# EAGLE design Smart Relay v2 (EAGLE 9.6.2)
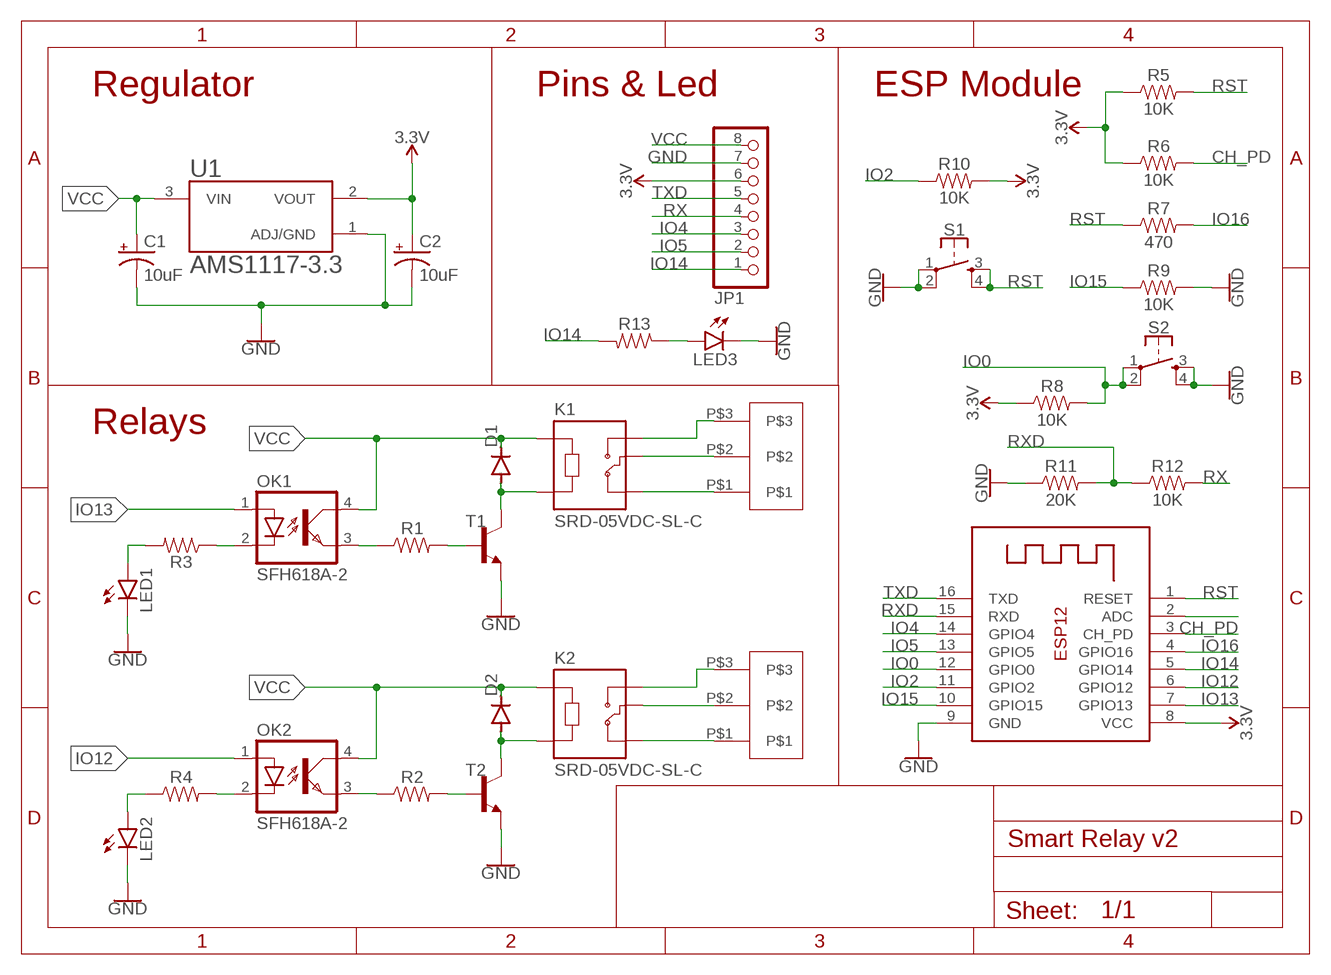
[diagram p0: schematic, sheet 1]

## Parts
C1  10uF  10UF-POLAR-EIA3216-16V-10%(TANT)  [EIA3216]
C2  10uF  10UF-POLAR-EIA3216-16V-10%(TANT)  [EIA3216]
D1  DIODE-SOD80C  [SOD80C]
D2  DIODE-SOD80C  [SOD80C]
JP1  PINHD-1X8  [1X08]
K1  SRD-05VDC-SL-C  [RELAY_SRD-05VDC-SL-C]
K2  SRD-05VDC-SL-C  [RELAY_SRD-05VDC-SL-C]
LED1  LEDCHIPLED_0805  [CHIPLED_0805]
LED2  LEDCHIPLED_0805  [CHIPLED_0805]
LED3  LEDCHIPLED_0805  [CHIPLED_0805]
OK1  SFH618A-2  [DIP4]
OK2  SFH618A-2  [DIP4]
R1  RESISTOR0805  [0805]
R2  RESISTOR0805  [0805]
R3  RESISTOR0805  [0805]
R4  RESISTOR0805  [0805]
R5  10K  RESISTOR0805  [0805]
R6  10K  RESISTOR0805  [0805]
R7  470  RESISTOR0805  [0805]
R8  10K  RESISTOR0805  [0805]
R9  10K  RESISTOR0805  [0805]
R10  10K  RESISTOR0805  [0805]
R11  20K  RESISTOR0805  [0805]
R12  10K  RESISTOR0805  [0805]
R13  RESISTOR0805  [0805]
S1  MOMENTARY-SWITCH-SPST-2-SMD-5.2MM-TALL  [TACTILE_SWITCH_SMD_5.2MM]
S2  MOMENTARY-SWITCH-SPST-2-SMD-5.2MM-TALL  [TACTILE_SWITCH_SMD_5.2MM]
T1  BC817-NPN-SOT23-BEC  [SOT23-BEC]
T2  BC817-NPN-SOT23-BEC  [SOT23-BEC]
U1  AMS1117-3.3  [SOT229P700X180-4N]
U$1  5MM_TERMINAL_3P  [5MM_TERMINAL_3P]
U$2  5MM_TERMINAL_3P  [5MM_TERMINAL_3P]
X1  ESP-12  [ESP-12]

## Nets
3.3V: C2.+ JP1.6 R5.1 R6.1 R8.1 R10.2 U1.2(VOUT) X1.8(VCC)
CH_PD: R6.2 X1.3(CH_PD)
GND: C1.- C2.- JP1.7 LED1.C LED2.C LED3.C R9.2 R11.1 S1.1 S1.2 S2.3 S2.4 T1.E T2.E U1.1(ADJ/GND) X1.9(GND)
IO0: R8.2 S2.1 S2.2 X1.12(GPIO0)
IO2: R10.1 X1.11(GPIO2)
IO4: JP1.3 X1.14(GPIO4)
IO5: JP1.2 X1.13(GPIO5)
IO12: OK2.1(A) X1.6(GPIO12)
IO13: OK1.1(A) X1.7(GPIO13)
IO14: JP1.1 R13.2 X1.5(GPIO14)
IO15: R9.1 X1.10(GPIO15)
IO16: R7.2 X1.4(GPIO16)
N$1: LED3.A R13.1
N$2: K2.NC U$2.P$1
N$3: D1.A K1.A2 T1.C
N$4: K2.COM U$2.P$2
N$5: D2.A K2.A2 T2.C
N$6: R2.2 T2.B
N$7: OK2.3(EMIT) R2.1
N$8: LED2.A R4.1
N$9: OK2.2(C) R4.2
N$10: OK1.3(EMIT) R1.1
N$11: R1.2 T1.B
N$12: LED1.A R3.2
N$13: OK1.2(C) R3.1
N$14: K2.NO U$2.P$3
N$15: X1.2(ADC)
N$16: K1.NC U$1.P$1
N$17: K1.COM U$1.P$2
N$18: K1.NO U$1.P$3
RST: R5.2 R7.1 S1.3 S1.4 X1.1(RESET)
RX: JP1.4 R12.2
RXD: R11.2 R12.1 X1.15(RXD)
TXD: JP1.5 X1.16(TXD)
VCC: C1.+ D1.C D2.C JP1.8 K1.A1 K2.A1 OK1.4(COL) OK2.4(COL) U1.3(VIN)

## Notes on the sheet
- Regulator | Pins & Led | ESP Module
- Relays

## Library data of the parts
C1 C2 = SparkFun-Capacitors:10UF-POLAR: 10.0µF polarized capacitors A capacitor is a passive two-terminal electrical component used to store electrical energy temporarily in an electric field.; PROD_ID: CAP-00811
D1 D2 = diode:DIODE-: DIODE
JP1 = pinhead:PINHD-1X8: PIN HEADER
K1 K2 = 5V Songle Röle:SRD-05VDC-SL-C: 5V Trigger Relay Module For Arduino And Raspberry Pi 5V Trigger Relay Module For Arduino And Raspberry Pi Check prices <https://pricing.snapeda.com/parts/SRD-05VDC-SL-C/Songle%20Relay/view-part?ref=eda>; AVAILABILITY: No availability data; DESCRIPTION: 5V Trigger Relay Module For Arduino And Raspberry Pi 5V Trigger Relay Module For Arduino And Raspberry Pi; MF: Songle Relay; MP: SRD-05VDC-SL-C; PACKAGE: None; PRICE: None
LED1-LED3 = led:LED: LED OSRAM: - CHIPLED LG R971, LG N971, LY N971, LG Q971, LY Q971, LO R971, LY R971 LH N974, LH R974 LS Q976, LO Q976, LY Q976 LO Q996 - Hyper CHIPLED LW Q18S LB Q993, LB Q99A, LB R99A - SideLED LS A670, LO A670, LY A670, LG A670, LP A670 LB A673, LV A673, LT A673, LW A673 LH A674 LY A675 LS A676, LA A676, LO A676, LY A676, LW A676 LS A679, LY A679, LG A679 - Hyper Micro SIDELED® LS Y876, LA Y876, LO Y876, LY Y876 LT Y87S - SmartLED LW L88C, LW L88S LB L89C, LB L89S, LG L890 LS L89K, LO L89K, LY L89K LS L896, LA L896, LO L896, LY L896 - TOPLED LS T670, LO T670, LY T670, LG T670, LP T670 LSG T670, LSP T670, LSY T670, LOP T670, LYG T670 LG T671, LOG T671, LSG T671 LB T673, LV T673, LT T673, LW T673 LH T674 LS T676, LA T676, LO T676, LY T676, LB T676, LH T676, LSB T676, LW T676 LB T67C, LV T67C, LT T67C, LS T67K, LO T67K, LY T67K, LW E67C LS E67B, LA E67B, LO E67B, LY E67B, LB E67C, LV E67C, LT E67C LW T67C LS T679, LY T679, LG T679 LS T770, LO T770, LY T770, LG T770, LP T770 LB T773, LV T773, LT T773, LW T773 LH T774 LS E675, LA E675, LY E675, LS T675 LS T776, LA T776, LO T776, LY T776, LB T776 LHGB T686 LT T68C, LB T68C - Hyper Mini TOPLED® LB M676 - Mini TOPLED Santana® LG M470 LS M47K, LO M47K, LY M47K Source: http://www.osram.convergy.de LUXEON: - LUMILED® LXK2-PW12-R00, LXK2-PW12-S00, LXK2-PW14-U00, LXK2-PW14-V00 LXK2-PM12-R00, LXK2-PM12-S00, LXK2-PM14-U00 LXK2-PE12-Q00, LXK2-PE12-R00, LXK2-PE12-S00, LXK2-PE14-T00, LXK2-PE14-U00 LXK2-PB12-K00, LXK2-PB12-L00, LXK2-PB12-M00, LXK2-PB14-N00, LXK2-PB14-P00, LXK2-PB14-Q00 LXK2-PR12-L00, LXK2-PR12-M00, LXK2-PR14-Q00, LXK2-PR14-R00 LXK2-PD12-Q00, LXK2-PD12-R00, LXK2-PD12-S00 LXK2-PH12-R00, LXK2-PH12-S00 LXK2-PL12-P00, LXK2-PL12-Q00, LXK2-PL12-R00 Source: www.luxeon.com KINGBRIGHT: KA-3528ASYC Source: www.kingbright.com
OK1 OK2 = optocoupler:SFH618?*: Optocoupler, Phototransistor Output, Low Input Current Source: Data sheet <http://www.vishay.com/docs/83673/sfh618.pdf>; MF: VISHAY/TELEFUNKEN; MPN: SFH618A-2; OC_FARNELL: 6424855; OC_NEWARK: 21H7744
R1-R13 = SparkFun-Resistors:RESISTOR: Generic Resistor Package
S1 S2 = SparkFun-Switches:MOMENTARY-SWITCH-SPST-2: Momentary Switch (Pushbutton) - SPST - Two Circuits Normally-open (NO) SPST momentary switches (buttons, pushbuttons). Schematic symbol includes two switch circuits. Variants SMD-4.6MMX2.8MM - 4.60mm x 2.80mm Tactile Momentary Button Switch - Used on SparkFun Pro Micro - RP2040 <https://www.sparkfun.com/products/17717> SMD-5.2MM - Mini Pushbutton Switch - SMD <https://www.sparkfun.com/products/8720> - Used on Arduino Pro Mini <https://www.sparkfun.com/products/11114>; PROD_ID: SWCH-14139
T1 T2 = transistor-neu-to92:*-NPN-: NPN Transistror
U1 = AMS1117-3.3:AMS1117-3.3: Sot223/Pkg 1-Amp 3.3-Volt Low Drop Out Voltage Regulatator Check prices <https://pricing.snapeda.com/parts/AMS1117-3.3/Advanced%20Monolithic%20Systems/view-part?ref=eda>; AVAILABILITY: In Stock; DESCRIPTION: Sot223/Pkg 1-Amp 3.3-Volt Low Drop Out Voltage Regulatator; MF: Advanced Monolithic Systems; MP: AMS1117-3.3; PACKAGE: SOT-223 Seeed Technology; PRICE: None
U$1 U$2 = 5 mm Terminal:5MM_TERMINAL_3P
X1 = adafruit:ESP-12

## Board
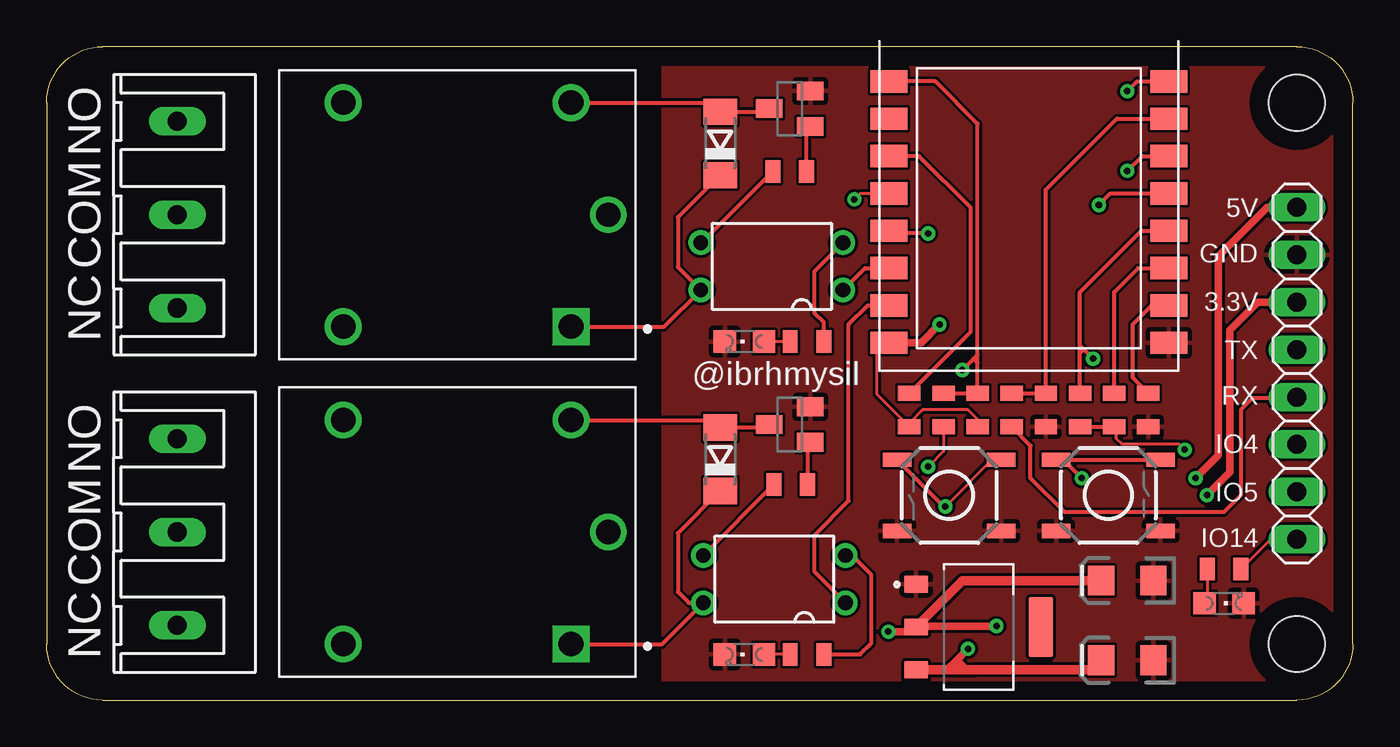
[diagram p1: board, top side]
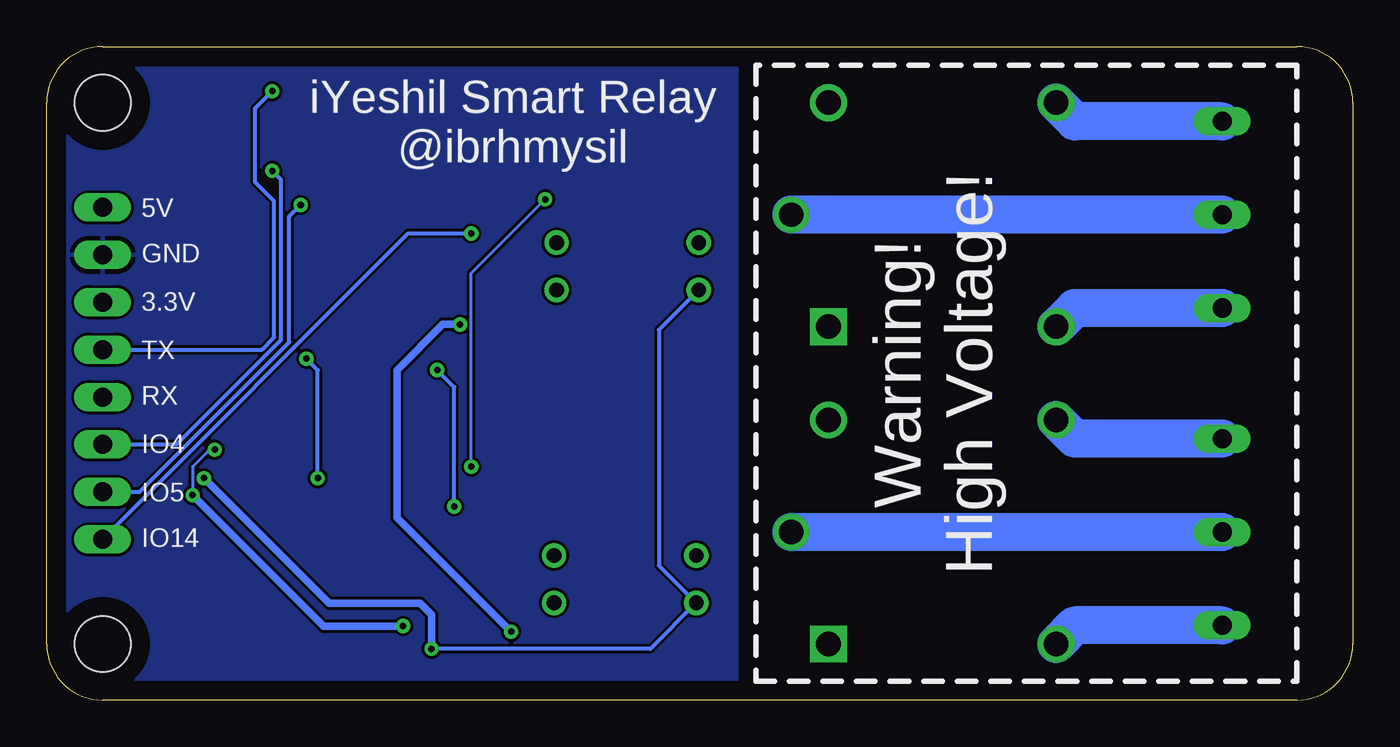
[diagram p2: board, bottom side, seen from below]

Size 70 x 35 mm. Coordinates in mm from the lower left corner, seen from the top.
Outline: 3,0 67,0 arc90 70,3 70,32 arc90 67,35 3,35 arc90 0,32 0,3 arc90 3,0
Copper layers (1*16): Top 0.035mm / dielectric 0.15mm / Bottom 0.035mm
Design rules "default": minimum track width 6mil, minimum drill 0.35mm, track to track 6mil, track to pad 6mil, pad to pad 6mil, via to via 6mil, smd to smd 6mil, copper to edge 40mil, drill to drill 6mil, minimum pad ring 10mil, minimum via ring 8mil, stop-mask expansion 4mil, vias tented up to drill 0mil, thermal gap 10mil
Holes 3 mm at 67,32 67,3

### Footprints (pad centres in the part's own frame; a part is rotated, then mirrored left to right if it is on the bottom)
EIA3216 = smd 1.4 x 1.6: + 1.4,0; - -1.4,0
SOD80C = smd 1.4 x 1.8: A 1.7,0; C -1.7,0
1X08 = drill 1.016 long: 1 -8.89,0; 2 -6.35,0; 3 -3.81,0; 4 -1.27,0; 5 1.27,0; 6 3.81,0; 7 6.35,0; 8 8.89,0
RELAY_SRD-05VDC-SL-C = drill 1.32 square: A1 -6.1,6 | drill 1.32: A2 -6.1,-6; NC 6.1,6; NO 6.1,-6 | drill 1.29: COM -8.1,0
CHIPLED_0805 = smd 1.2 x 1.2: A 0,-1.05; C 0,1.05
DIP4 = drill 0.8: 1 -1.27,-3.81; 2 1.27,-3.81; 3 1.27,3.81; 4 -1.27,3.81
0805 = smd 0.8 x 1.2: 1 -0.9,0; 2 0.9,0
TACTILE_SWITCH_SMD_5.2MM = smd 1.524 x 0.762: 1 -2.794,1.905; 2 2.794,1.905; 3 -2.794,-1.905; 4 2.794,-1.905
SOT23-BEC = smd 1 x 1.4: B -0.95,-1.1; C 0,1.1; E 0.95,-1.1
SOT229P700X180-4N = smd 0.93 x 1.31: 1 -2.29,-3.345; 2 0,-3.345; 3 2.29,-3.345 | smd 3.24 x 1.31: 4 0,3.345
5MM_TERMINAL_3P = drill 1.02 long: P$1 -5,0; P$2 0,0; P$3 5,0
ESP-12 = smd 2 x 1.2: 1 -7.5,4.5; 2 -7.5,2.5; 3 -7.5,0.5; 4 -7.5,-1.5; 5 -7.5,-3.5; 6 -7.5,-5.5; 7 -7.5,-7.5; 8 -7.5,-9.5; 9 7.5,-9.5; 10 7.5,-7.5; 11 7.5,-5.5; 12 7.5,-3.5; 13 7.5,-1.5; 14 7.5,0.5; 15 7.5,2.5; 16 7.5,4.5

### Placement (x,y rotation side)
C1  57.91,2.13 180 top
C2  57.91,6.4 180 top
D1  36.09,12.9 90 top
D2  36.09,29.82 90 top
JP1  67,17.5 90 top
K1  22,9 180 top
K2  22,26 180 top
LED1  37.39,2.44 90 top
LED2  37.39,19.2 90 top
LED3  63.09,5.18 270 top
OK1  39,6.47 90 top
OK2  38.86,23.23 90 top
R1  39.88,11.54 0 top
R2  39.82,28.32 0 top
R3  40.75,2.44 180 top
R4  40.75,19.2 0 top
R5  49.89,15.53 90 top
R6  46.23,15.53 90 top
R7  48.06,15.53 270 top
R8  55.38,15.53 90 top
R9  59.04,15.53 270 top
R10  57.21,15.53 270 top
R11  53.55,15.53 90 top
R12  51.72,15.53 270 top
R13  63.09,7.01 0 top
S1  48.37,10.96 180 top
S2  56.9,10.96 0 top
T1  39.82,14.76 90 top
T2  39.82,31.68 90 top
U1  49.94,3.91 270 top
U$1  7,9 90 top
U$2  7,26 90 top
X1  52.63,28.64 0 top

### Tracks (layer width: path | path; a pad name or v marks a point on that pad's centre or on a via)
3.3V  (via drill 0.35)
  Top 0.152: R10.2 57.3,14.54 57.3,14.02 57.61,13.72 60.68,13.72 v60.99,13.41 | R5.1 49.89,15.03 49.38,15.54 46.94,15.54 46.23,14.84 R6.1 44.5,16.37 44.5,19.2 45.07,19.2 X1.8
  Top 0.203: R8.1 R10.2
  Top 0.406: JP1.6 64.9,21.31 63.4,19.81 63.4,12.19 v62.18,10.97 | v50.9,3.96 46.65,3.96 U1.2 46.34,3.66 v45.11,3.66 | X1.8 46.88,19.14 v47.85,20.12
  Top 0.508: U1.2 49.09,6.4 C2.+
  Bottom 0.152: v60.99,13.41 61.27,13.41 62.18,12.5 v62.18,10.97
  Bottom 0.406: v62.18,10.97 55.17,3.96 v50.9,3.96 | v47.85,20.12 48.77,20.12 51.21,17.68 51.21,9.75 v45.11,3.66
CH_PD
  Top 0.203: R6.2 49.53,19.73 49.53,26.36 46.75,29.14 X1.3
GND
  pour Top: 33,1 69,1 69,34 33,34
  pour Bottom: 33,1 69,1 69,34 33,34
IO0  (via drill 0.35)
  Top 0.203: R8.2 55.38,18.59 | 55.38,18.59 55.38,18.99 | 55.38,18.99 55.38,21.85 58.67,25.14 X1.12 | S2.2 S2.1 54.49,12.87 v55.47,11.89 | v56.08,18.29 55.63,18.75 | 55.63,18.75 55.47,18.9 55.38,18.99 | 55.38,18.59 55.53,18.75 55.63,18.75
  Bottom 0.203: v55.47,11.89 55.47,17.68 v56.08,18.29
IO2
  Top 0.203: R10.1 57.21,21.85 58.5,23.14 X1.11
IO4  (via drill 0.35)
  Top 0.203: v57.91,28.35 58.71,29.14 X1.14
  Bottom 0.203: JP1.3 63.04,13.69 57.45,19.27 57.45,27.89 v57.91,28.35
IO5  (via drill 0.35)
  Top 0.203: v56.39,26.52 57.01,27.14 X1.13
  Bottom 0.203: JP1.2 65.02,11.15 57,19.17 57,25.91 v56.39,26.52
IO12
  Top 0.203: OK2.1 43.85,23.14 X1.6
IO13
  Top 0.203: OK1.1 41.15,6.86 41.15,8.84 42.98,10.67 42.98,20.12 44,21.14 X1.7
IO14  (via drill 0.35)
  Top 0.152: R13.2 65.59,8.61 JP1.1
  Top 0.203: v47.24,24.99 45.28,24.99 X1.5
  Bottom 0.203: JP1.1 50.62,24.99 v47.24,24.99
IO15
  Top 0.203: R9.1 58.22,17.25 58.22,20.12 59.24,21.14 X1.10
IO16  (via drill 0.35)
  Top 0.152: R7.2 48.06,13.31 v47.24,12.5 | v43.28,26.82 43.6,27.14 X1.4
  Bottom 0.152: v47.24,12.5 47.24,22.86 v43.28,26.82
N$1
  Top 0.152: R13.1 62.19,5.33 LED3.A
N$2
  Bottom 2.032: U$2.P$1 14.9,21 K2.NC
N$3
  Top 0.203: K1.A2 35.69,15 D1.A 38.56,14.6 T1.C
N$4
  Bottom 2.032: U$2.P$2 K2.COM
N$5
  Top 0.203: K2.A2 35.61,32 D2.A 38.56,31.52 T2.C
N$6
  Top 0.203: R2.2 40.72,30.53 T2.B
N$7
  Top 0.203: R2.1 35.1,24.5 OK2.3
N$8
  Top 0.152: R4.1 LED2.A
N$9
  Top 0.203: R4.2 41.65,20.23 41.15,20.73 41.15,22.98 OK2.2
N$10
  Top 0.203: R1.1 35.19,7.76 OK1.3
N$11
  Top 0.203: T1.B 40.77,13.66 R1.2
N$12
  Top 0.152: R3.2 LED1.A
N$13
  Top 0.203: OK1.2 43.16,7.74 44.2,6.71 44.2,3.05 43.59,2.44 R3.1
N$14
  Bottom 2.032: U$2.P$3 14.9,31 K2.NO
N$16
  Bottom 2.032: U$1.P$1 14.9,4 K1.NC
N$17
  Bottom 2.032: U$1.P$2 K1.COM
N$18
  Bottom 2.032: U$1.P$3 14.9,14 K1.NO
RST  (via drill 0.35)
  Top 0.152: v48.16,10.36 50.66,12.87 S1.3
  Top 0.203: R7.1 R5.2 49.89,18.08 | 49.89,18.08 49.89,18.5 | 49.89,18.5 49.89,30.88 47.63,33.14 X1.1 | S1.4 48.08,10.36 v48.16,10.36 | v49.07,17.68 49.68,18.29 | 49.68,18.29 49.89,18.5 | 49.68,18.29 49.89,18.08
  Bottom 0.203: v48.16,10.36 48.16,16.76 v49.07,17.68
RX
  Top 0.203: JP1.4 66.92,16.15 64.62,16.15 64.01,15.54 64.01,10.97 63.09,10.06 54.56,10.06 52.73,11.89 52.73,13.62 R12.2
RXD
  Top 0.203: R12.1 R11.2 53.55,27.34 57.35,31.14 X1.15
TXD  (via drill 0.35)
  Top 0.203: v57.91,32.61 58.44,33.14 X1.16
  Bottom 0.203: JP1.5 58.46,18.77 57.81,19.42 57.81,26.72 58.83,27.74 58.83,31.7 v57.91,32.61
VCC  (via drill 0.35)
  Top 0.203: K1.A1 32.98,3 OK1.4 34.42,5.2 33.83,5.79 33.83,8.94 D1.C | K2.A1 33.09,20 OK2.4 33.83,23.18 33.83,25.86 D2.C
  Top 0.406: JP1.8 65.4,26.39 62.79,23.77 62.79,13.11 v61.57,11.89 | v49.38,2.74 48.77,2.13 | 48.77,2.13 48.25,1.62 U1.3 | 49.68,1.62 49.28,1.62 48.77,2.13
  Top 0.508: C1.+ 56,1.62 49.68,1.62 U1.3
  Bottom 0.203: OK2.4 37.19,19.83 37.19,7.2 OK1.4 37.65,2.74 v49.38,2.74
  Bottom 0.406: v61.57,11.89 54.86,5.18 49.99,5.18 49.38,4.57 v49.38,2.74

### Text on the board
tNames: NO | COM | 5V | GND | NC | 3.3V | TX | @ibrhmysil | RX | NO | IO4 | IO5 | COM | IO14 | NC
bNames: iYeshil Smart Relay / @ibrhmysil | 5V | GND | 3.3V | TX | Warning! / High Voltage! | RX | IO4 | IO5 | IO14